# Altium project PROJECT-BQ24072-BREAKOUT.PrjPcb
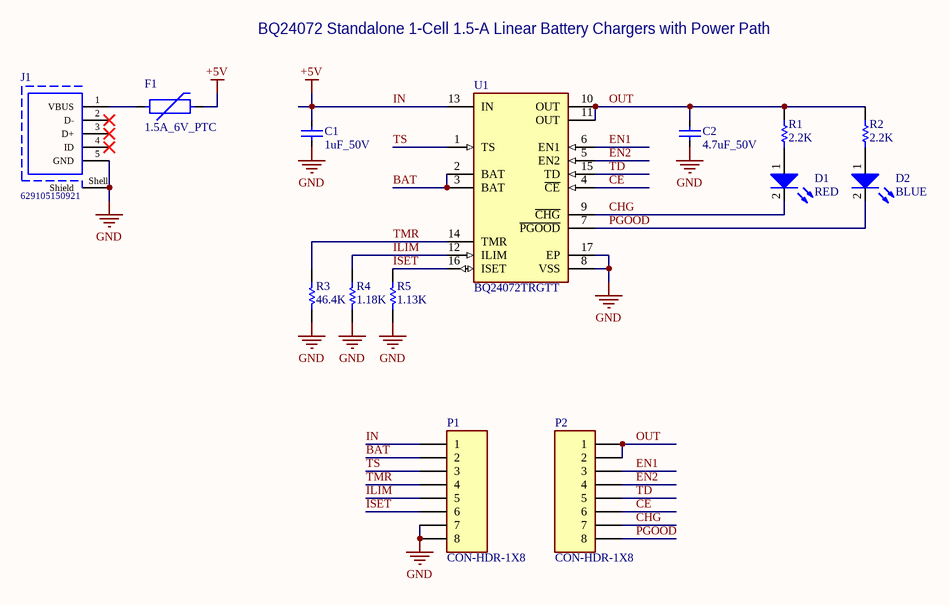
[diagram p0: BQ24072-BREAKOUT.SchDoc]
1 sheet, 14 parts. Net scope: global (net labels, ports and power ports of the same name join across sheets).
Board file: BQ24072-BREAKOUT.PcbDoc

## Sheet BQ24072-BREAKOUT.SchDoc: BQ24072 Breakout Board
size A4; Author: Meysam Parvizi; DrawnBy: Meysam Parvizi; SheetNumber: 1; SheetTotal: 1

### Parts
C1  value 1uF_50V  [C0805]  (hidden comment: C0805C104K5RAC7411)
C2  value 4.7uF_50V  [C0805]  (hidden comment: C0805C104K5RAC7411)
D1  RED  [LED0805]
D2  BLUE  [LED0805]
F1  value 1.5A_6V_PTC  [R1206]  (hidden comment: NANOSMDC150F)
J1  629105150921  [CON-MICRO-USB-B-SMD-WITH-HOLDER]
P1  CON-HDR-1X8  [CON-HDR-1X8-2.54]
P2  CON-HDR-1X8  [CON-HDR-1X8-2.54]
R1  value 2.2K  [R0805]  (hidden comment: CRG0805F10K)
R2  value 2.2K  [R0805]  (hidden comment: CRG0805F10K)
R3  value 46.4K  [R0805]  (hidden comment: CRG0805F10K)
R4  value 1.18K  [R0805]  (hidden comment: CRG0805F10K)
R5  value 1.13K  [R0805]  (hidden comment: CRG0805F10K)
U1  BQ24072TRGTT  [VQFN-16]

### Nets
GND: C1.2 C2.2 J1.5(GND) J1.Shell(Shield) P1.7 P1.8 R3.1 R4.1 R5.1 U1.8(VSS) U1.17(EP)
IN: C1.1 F1.2 P1.1 U1.13(IN)  [also labelled +5V]
BAT: P1.2 U1.2(BAT) U1.3(BAT)
CE: P2.6 U1.4(~{CE})
CHG: D1.2(K) P2.7 U1.9(~{CHG})
EN1: P2.3 U1.6(EN1)
EN2: P2.4 U1.5(EN2)
ILIM: P1.5 R4.2 U1.12(ILIM)
ISET: P1.6 R5.2 U1.16(ISET)
OUT: C2.1 P2.1 P2.2 R1.1 R2.1 U1.10(OUT) U1.11(OUT)
PGOOD: D2.2(K) P2.8 U1.7(~{PGOOD})
TD: P2.5 U1.15(TD)
TMR: P1.4 R3.2 U1.14(TMR)
TS: P1.3 U1.1(TS)
NetD1_1: D1.1(A) R1.2
NetD2_1: D2.1(A) R2.2
NetF1_1: F1.1 J1.1(VBUS)

Not connected (* = marked no-connect by the designer): J1 2(D-)* 3(D+)* 4(ID)*

### Notes on the sheet
- BQ24072 Standalone 1-Cell 1.5-A Linear Battery Chargers with Power Path
- Title:
- Designed By:
- Meysam Parvizi
- GitHub:
- https://github.com/m3y54m
- File:
- Project Git Hash:
- Project:
- Date:
- Sheet
- Revision:
- of
- Size:
- A4
- File Git Hash:

### Library data of the parts
C1 C2 = CAPACITOR: C0805 0.10 μF X7R 30ppm/°C 10.00% 50 V; Manufacturer: KEMET; Material: Ceramic; Tolerance: 0.1; Capacitance: 100nF; Voltage Rating: 50 V; Temperature: -55°C to +125°C; Device Class L3: Ceramic Capacitors; Temperature Characteristic: X7R; Device Class L1: Passive Components; Category: Cap; Temperature Coefficient: 30ppm/°C; Manufacturer Part Number: C0805C104K5RAC7411; Temperature Range High: +125°C; Height: 0.88mm; RoHS: TRUE; ComponentLink2Description: Datasheet; Lead Free: Yes; Package: C0805C-DN; Temperature Range Low: -55°C; ComponentLink2URL: https://content.kemet.com/datasheets/KEM_C1003_C0G_SMD.pdf; Automotive: No; Ipc Land Pattern Name: CAPC200125X78; Octopart: https://octopart.com/c0805c104k5rac7411-kemet-18508045; Device Class L2: Capacitors
D1 D2 = LED: Typical LED
F1 = FUSE-PTC: FUSE PPTC 1.5A (1206) 6V RESETTABLE
J1 = CON-MICRO-USB-AB-RCPT-SMD: Micro USB 2.0 Type AB Receptacle WR-COM, Horizontal, SMT; Manufacturer: Wurth Elektronik; Rated Current: 1.8A; Contact Resistance: 30mOhm; Working Voltage: 30VAC; Publisher: WurthElektronik; Part Number: 629105150921; Operating Temperature: -40to85degC; Gender: Receptacle; Packaging: TapeandReel; Connector Type: MicroUSB2.0TypeAB; Datasheet URL: https://katalog.we-online.de/em/datasheet/629105150921.pdf; Mounting Technology: SMT; Orientation: Horizontal; Package Reference: 629105150921; Manufacturer URL: http://www.we-online.de
P1 P2 = CON-HDR-1X8: Pin Header, 8-Pin; LatestRevisionDate: 17-Jul-2002; LatestRevisionNote: Re-released for DXP Platform.; Publisher: Altium Limited
R1-R5 = RESISTOR: RES SMD 10K OHM 1% 1/8W 0805; Temperature Coefficient: 100ppm/°C; Power Rating: 125mW; Voltage Rating: 150V; Number of Resistors: 1; RoHS Compliant: Yes; Tolerance: 1%; Mount: Surface Mount; Radiation Hardening: No; Depth: 1.25mm; Termination: Solder; Series: CRG Series; Packaging: Tape and Reel; Number of Terminations: 2; Resistor Type: Thick Film; Length: 2mm; Height: 0.55mm; ELV: Compliant; Case/Package: 0805; Min Operating Temperature: -55°C; Max Operating Temperature: 125°C; Technology: THICK FILM
U1 = BQ24072: 1.5 A USB-Friendly Li-Ion Battery Charger and Power-Path Management IC, 4.3 V, -40 to 85 degC, 16-pin QFN (RGT), Green (RoHS & no Sb/Br); Manufacturer: Texas Instruments; Lead Acid: N; Vin(Min)(V): 4.3; Li-Polymer: Y; SubFamily: Battery Charge Management; NiCd: N; Over Voltage Protection: N; PartNumber: BQ24072TRGTT; ComponentLink1Description: Datasheet; Code_JEDEC: MO-220; DatasheetVersion: SLUS937A; Eco-Plan: Green (RoHS & no Sb/Br); Mounting Technology: Surface Mount; ComponentLink1URL: http://www.ti.com/general/docs/lit/getliterature.tsp?genericPartNumber=BQ24072T&fileType=pdf; NiMH: N; PackageReference: RGT0016C; Li-Ion: Y; PackageDescription: 16-Pin Plastic Quad Flat No-Lead, 3 x 3 mm Body, 0.5 mm Pitch, 1.7 x 1.7 mm Exposed Pad; PackageVersion: revH, Oct-2011